# Altium schematic sheet Sheet1.SchDoc
size A; SheetNumber: 1; SheetTotal: 1
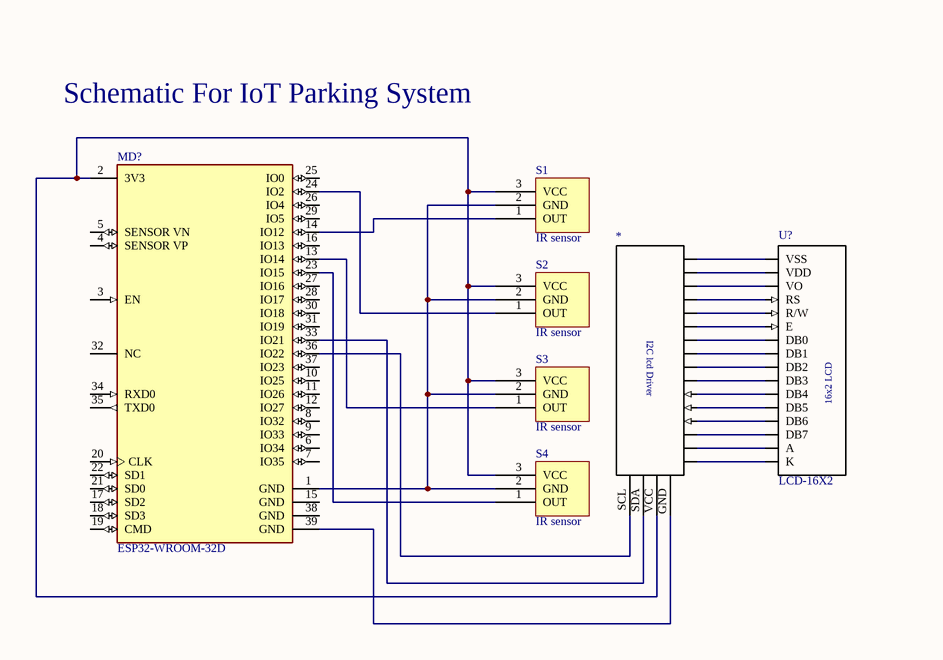
[diagram p0: Sheet1.SchDoc, left]
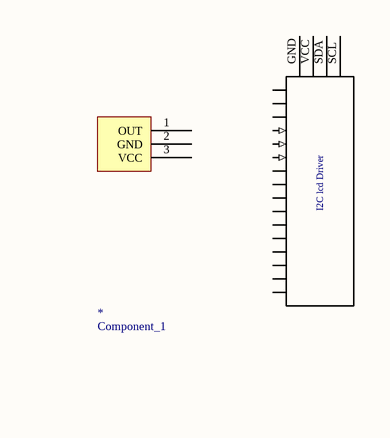
[diagram p1: Sheet1.SchDoc, right]

## Parts
(Parts that share a designator on the sheet are numbered #1, #2 ... from top to bottom, then left to right.)
*#1  Component_1
*#2  (no value)
MD?  ESP32-WROOM-32D  [FP-ESP32-WROOM-32D-MFG]
S1  IR sensor
S2  IR sensor
S3  IR sensor
S4  IR sensor
U?  LCD-16X2  [*LCD-16X2]

## Nets
Net*#2_1: *#2.1 U?.16(K)
Net*#2_2: *#2.2 U?.15(A)
Net*#2_3: *#2.3 U?.14(DB7)
Net*#2_4: *#2.4 U?.13(DB6)
Net*#2_5: *#2.5 U?.12(DB5)
Net*#2_6: *#2.6 U?.11(DB4)
Net*#2_7: *#2.7 U?.10(DB3)
Net*#2_8: *#2.8 U?.9(DB2)
Net*#2_9: *#2.9 U?.8(DB1)
Net*#2_10: *#2.10 U?.7(DB0)
Net*#2_11: *#2.11 U?.6(E)
Net*#2_12: *#2.12 U?.5(R/W)
Net*#2_13: *#2.13 U?.4(RS)
Net*#2_14: *#2.14 U?.3(VO)
Net*#2_15: *#2.15 U?.2(VDD)
Net*#2_16: *#2.16 U?.1(VSS)
Net*#2_GND: *#2.GND MD?.39(GND)
Net*#2_SCL: *#2.SCL MD?.36(IO22)
Net*#2_SDA: *#2.SDA MD?.33(IO21)
Net*#2_VCC: *#2.VCC MD?.2(3V3) S1.3(VCC) S2.3(VCC) S3.3(VCC) S4.3(VCC)
NetMD?_1: MD?.1(GND) S1.2(GND) S2.2(GND) S3.2(GND) S4.2(GND)
NetMD?_13: MD?.13(IO14) S3.1(OUT)
NetMD?_14: MD?.14(IO12) S1.1(OUT)
NetMD?_23: MD?.23(IO15) S4.1(OUT)
NetMD?_24: MD?.24(IO2) S2.1(OUT)

Not connected (* = marked no-connect by the designer): *#1 1(OUT) 2(GND) 3(VCC) 4 5 6 7 8 9 10 11 12 13 14 15 16 GND SCL SDA VCC; MD? 3(EN) 4(SENSOR_VP) 5(SENSOR_VN) 6(IO34) 7(IO35) 8(IO32) 9(IO33) 10(IO25) 11(IO26) 12(IO27) 15(GND) 16(IO13) 17(SD2) 18(SD3) 19(CMD) 20(CLK) 21(SD0) 22(SD1) 25(IO0) 26(IO4) 27(IO16) 28(IO17) 29(IO5) 30(IO18) 31(IO19) 32(NC) 34(RXD0) 35(TXD0) 37(IO23) 38(GND)

## Notes on the sheet
- Schematic For IoT Parking System
- (in symbol Component_1) I2C lcd Driver
- (in symbol LCD-16X2) 16x2 LCD

## Library data of the parts
*#2 S1-S4 = Component_1
MD? = CMP-194065-000003-1: WIFI MODULE 32MBITS SPI FLASH; Manufacturer: Espressif Systems; Max Supply Voltage: 3.6V; Nominal Supply Current: 500mA; Max Frequency: 2484MHz; Number Of Adc Channels: 16; Number Of Gpio: 32; Interface: I2C,SPI,UART,Ethernet,I2S,Other; Data Rate: 150Mbits/s; Min Supply Voltage: 3V; Bandwidth: 72MHz; Sensitivity: -98dBm; Octopart: https://octopart.com/esp32-wroom-32d-espressif+systems-91040050; Package: ESP32-WROOM-32D; ComponentLink2URL: https://www.espressif.com/sites/default/files/documentation/esp32-wroom-32d_esp32-wroom-32u_datasheet_en.pdf; Lead Free: Yes; Category: UNK; Mouser Description: Wi-Fi/BT BLE Module ESP32-D0WD, SPI Flash, UART, P; Device Class L1: Integrated Circuits (ICs); RoHS: TRUE; Temperature Range Low: -40°C; ComponentLink2Description: Datasheet; Digikey Description: WIFI MODULE 32MBITS SPI FLASH; Height: 3.2mm; Temperature: -40°C to +85°C; Manufacturer Part Number: ESP32-WROOM-32D; Device Class L3: Transceivers; Device Class L2: RF Semiconductors and Devices; Temperature Range High: +85°C; Automotive: No
U? = LCD-16X2: Display Development Tools 16x2 Black on Green Char LCD w Backlight; MF: Gravitech; Check_prices: https://www.snapeda.com/parts/LCD-16X2/Gravitech/view-part/?ref=eda; SnapEDA_Link: https://www.snapeda.com/parts/LCD-16X2/Gravitech/view-part/?ref=snap; Availability: Not in stock; Price: None; MP: LCD-16X2; Package: None; Value: *